# EAGLE design BASEBOARD-2-V.1.0 (EAGLE 5.06)
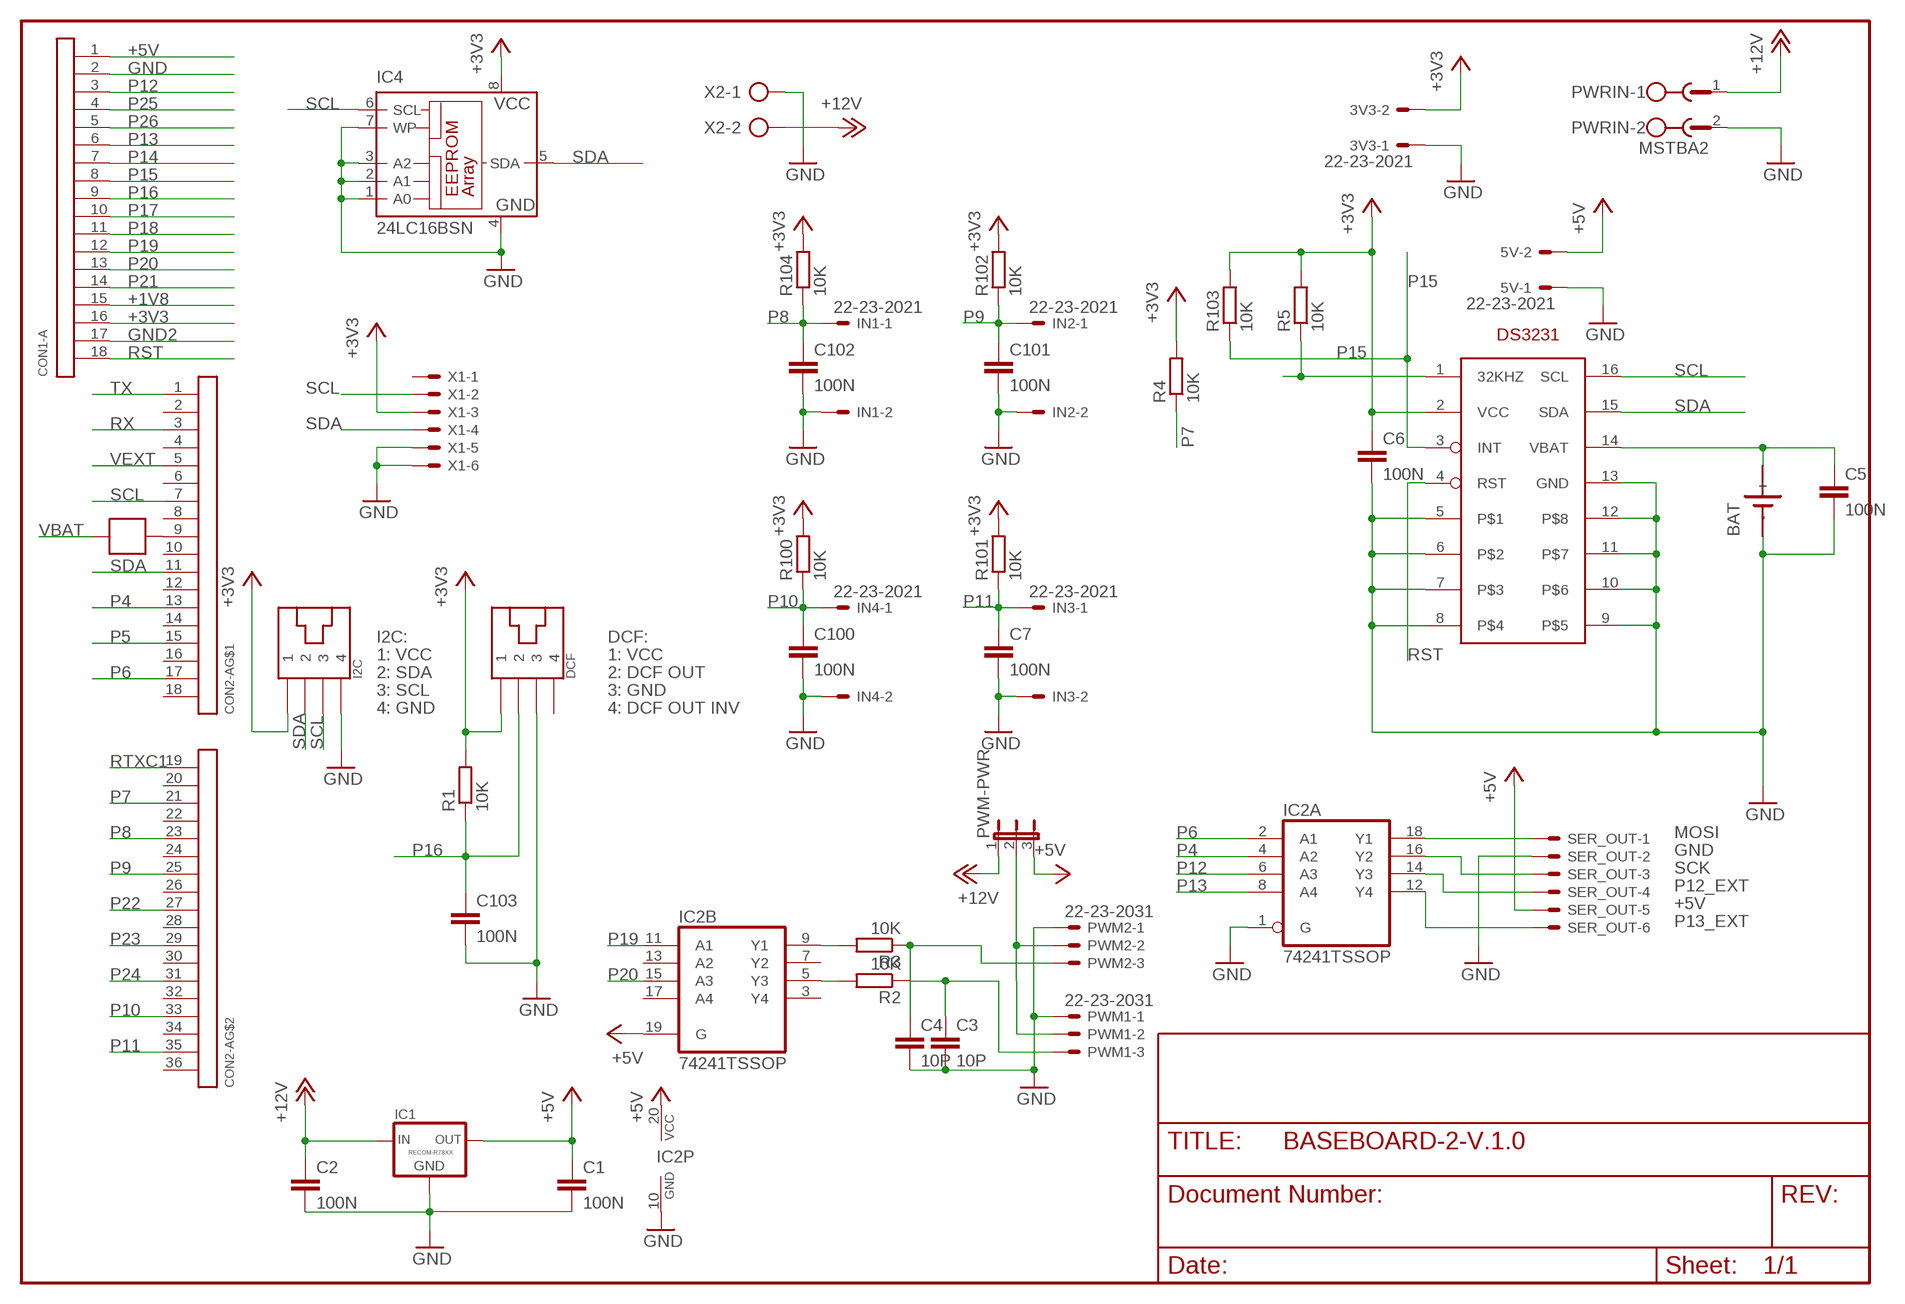
[diagram p0: schematic, sheet 1]

## Parts
3V3  22-23-2021  [22-23-2021]
5V  22-23-2021  [22-23-2021]
BAT  SN2032  [SN2032]
C1  100N  C-EUC0805  [C0805]
C2  100N  C-EUC0805  [C0805]
C3  10P  C-EUC0805  [C0805]
C4  10P  C-EUC0805  [C0805]
C5  100N  C-EUC0805  [C0805]
C6  100N  C-EUC0805  [C0805]
C7  100N  C-EUC0805  [C0805]
C100  100N  C-EUC0805  [C0805]
C101  100N  C-EUC0805  [C0805]
C102  100N  C-EUC0805  [C0805]
C103  100N  C-EUC0805  [C0805]
CON1-A  CON18ARMCON  [CON-ARMED-18-1]
CON2-A  CON18-2  [CON-ARMED-18-2]
DCF  PC_INTERNAL_AUDIO_4  [PC_INTERNAL_AUDIO_4]
I2C  PC_INTERNAL_AUDIO_4  [PC_INTERNAL_AUDIO_4]
IC1  RECOM-R78XX  [RECOM-R785]
IC2  74241TSSOP  [TSSOP20]
IC3  DS3231  [SO16]
IC4  24LC16BSN  [SO-08]
IN1  22-23-2021  [22-23-2021]
IN2  22-23-2021  [22-23-2021]
IN3  22-23-2021  [22-23-2021]
IN4  22-23-2021  [22-23-2021]
PWM1  22-23-2031  [22-23-2031]
PWM2  22-23-2031  [22-23-2031]
PWM-PWR  JP2E  [JP2]
PWRIN  MSTBA2  [MSTBA2]
R1  10K  R-EU_M0805  [M0805]
R2  10K  R-EU_M0805  [M0805]
R3  10K  R-EU_M0805  [M0805]
R4  10K  R-EU_M0805  [M0805]
R5  10K  R-EU_M0805  [M0805]
R100  10K  R-EU_M0805  [M0805]
R101  10K  R-EU_M0805  [M0805]
R102  10K  R-EU_M0805  [M0805]
R103  10K  R-EU_M0805  [M0805]
R104  10K  R-EU_M0805  [M0805]
SER_OUT  22-23-2061  [22-23-2061]
U$1  SOLDERJUMPER  [SOLDERJUMP1]
X1  22-23-2061  [22-23-2061]
X2  AK500/2  [AK500/2]

## Nets
32KHZ: IC3.1(32KHZ) R5.1
+1V8: CON1-A.15
+3V3: 3V3.2 C6.1 CON1-A.16 DCF.P$1 I2C.P$1 IC3.2(VCC) IC4.8(VCC) R1.2 R4.2 R5.2 R100.2 R101.2 R102.2 R103.2 R104.2 X1.3
+5V: 5V.2 C1.1 CON1-A.1 IC1.3(OUT) IC2.19(B:G) IC2.20(P:VCC) PWM-PWR.3 SER_OUT.5
+12V: C2.1 IC1.1(IN) PWM-PWR.1 PWRIN.1 X2.2
GND: 3V3.1 5V.1 BAT.- C1.2 C2.2 C3.2 C4.2 C5.2 C6.2 C7.2 C100.2 C101.2 C102.2 C103.2 CON1-A.2 DCF.P$3 I2C.P$4 IC1.2(GND) IC2.1(A:G) IC2.10(P:GND) IC3.5 IC3.6 IC3.7 IC3.8 IC3.9 IC3.10 IC3.11 IC3.12 IC3.13(GND) IC4.1(A0) IC4.2(A1) IC4.3(A2) IC4.4(GND) IC4.7(WP) IN1.2 IN2.2 IN3.2 IN4.2 PWM1.1 PWM2.1 PWRIN.2 SER_OUT.2 X1.5 X1.6 X2.1
GND2: CON1-A.17
MOSI: IC2.18(A:Y1) SER_OUT.1
N$5: C4.1 PWM2.3 R3.1
N$6: C3.1 PWM1.3 R2.1
N$7: PWM1.2 PWM2.2 PWM-PWR.2
N$8: IC2.9(B:Y1) R3.2
N$9: IC2.5(B:Y3) R2.2
N$10: CON2-A.9 U$1.1
P4: CON2-A.13 IC2.4(A:A2)
P5: CON2-A.15
P6: CON2-A.17 IC2.2(A:A1)
P7: CON2-A.21 R4.1
P8: C102.1 CON2-A.23 IN1.1 R104.1
P9: C101.1 CON2-A.25 IN2.1 R102.1
P10: C100.1 CON2-A.33 IN4.1 R100.1
P11: C7.1 CON2-A.35 IN3.1 R101.1
P12: CON1-A.3 IC2.6(A:A3)
P12_EXT: IC2.14(A:Y3) SER_OUT.4
P13: CON1-A.6 IC2.8(A:A4)
P13_EXT: IC2.12(A:Y4) SER_OUT.6
P14: CON1-A.7
P15: CON1-A.8 IC3.3(INT) R103.1
P16: C103.1 CON1-A.9 DCF.P$2 R1.1
P17: CON1-A.10
P18: CON1-A.11
P19: CON1-A.12 IC2.11(B:A1)
P20: CON1-A.13 IC2.15(B:A3)
P21: CON1-A.14
P22: CON2-A.27
P23: CON2-A.29
P24: CON2-A.31
P25: CON1-A.4
P26: CON1-A.5
RST: CON1-A.18 IC3.4(RST)
RTXC1: CON2-A.19
RX: CON2-A.3
SCK: IC2.16(A:Y2) SER_OUT.3
SCL: CON2-A.7 I2C.P$3 IC3.16(SCL) IC4.6(SCL) X1.2
SDA: CON2-A.11 I2C.P$2 IC3.15(SDA) IC4.5(SDA) X1.4
TX: CON2-A.1
VBAT: BAT.+ C5.1 IC3.14(VBAT) U$1.2
VEXT: CON2-A.5
Unconnected: CON2-A.2 CON2-A.4 CON2-A.6 CON2-A.8 CON2-A.10 CON2-A.12 CON2-A.14 CON2-A.16 CON2-A.18 CON2-A.20 CON2-A.22 CON2-A.24 CON2-A.26 CON2-A.28 CON2-A.30 CON2-A.32 CON2-A.34 CON2-A.36 DCF.P$4 IC2.3(B:Y4) IC2.7(B:Y2) IC2.13(B:A2) IC2.17(B:A4) X1.1

## Notes on the sheet
- I2C: | DCF:
- 1: VCC | 1: VCC
- 2: SDA | 2: DCF OUT
- 3: SCL | 3: GND
- 4: GND | 4: DCF OUT INV

## Library data of the parts
3V3 5V IN1-IN4 = con-molex:22-23-2021: .100" (2.54mm) Center Header - 2 Pin
BAT = turbod3:SN2032: LI BATTERY
C1-C7 C100-C103 = turbod3:C-EU: CAPACITOR, European symbol
CON1-A = turbod3:CON18
CON2-A = turbod3:CON18-2
DCF I2C = turbod3:PC_INTERNAL_AUDIO_4
IC1 = turbod3:RECOM-R78XX
IC2 = 74xx-eu:74*241: Octal BUFFER and LINE DRIVER, 3-state
IC3 = DS3231:DS3231
IC4 = microchip-5:24*: Serial EEPROM I2C
PWM1 PWM2 = con-molex:22-23-2031: .100" (2.54mm) Center Header - 3 Pin
PWM-PWR = jumper:JP2E: JUMPER
PWRIN = con-phoenix-508:MSTBA2: PHOENIX
R1-R5 R100-R104 = turbod3:R-EU_: RESISTOR, European symbol
SER_OUT X1 = con-molex:22-23-2061: .100" (2.54mm) Center Header - 6 Pin
U$1 = turbod3:SOLDERJUMPER
X2 = con-ptr500:AK500/2: CONNECTOR

## Board
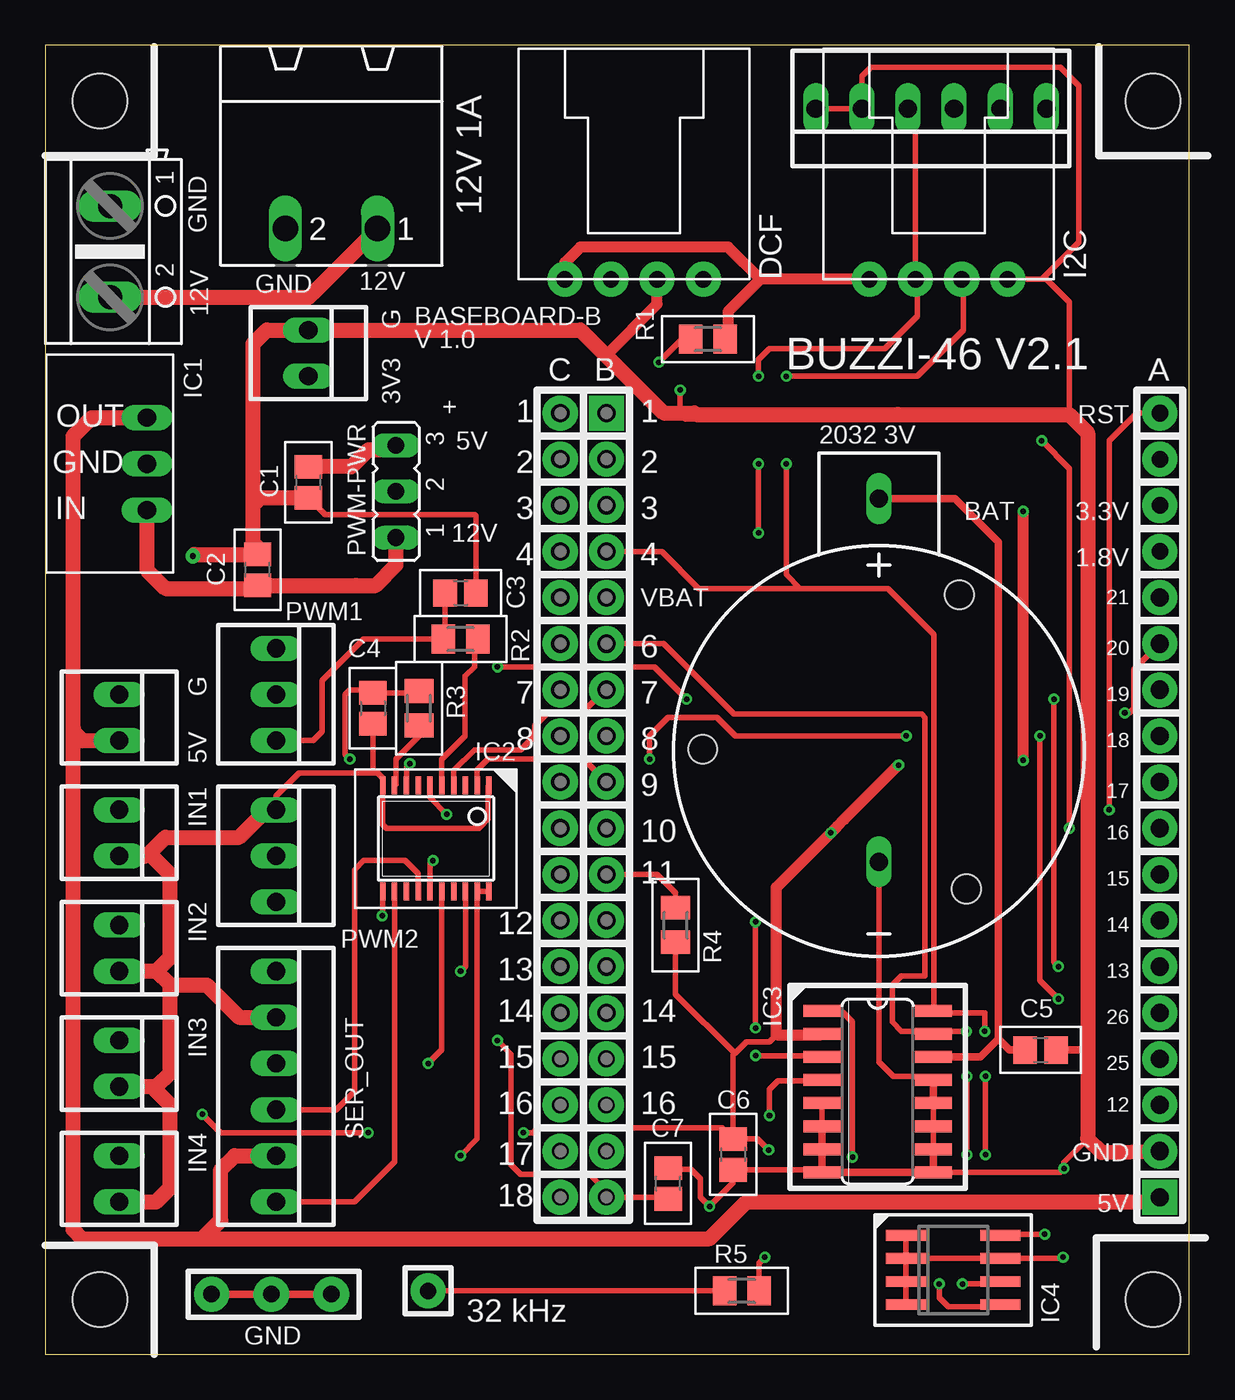
[diagram p1: board, top side]
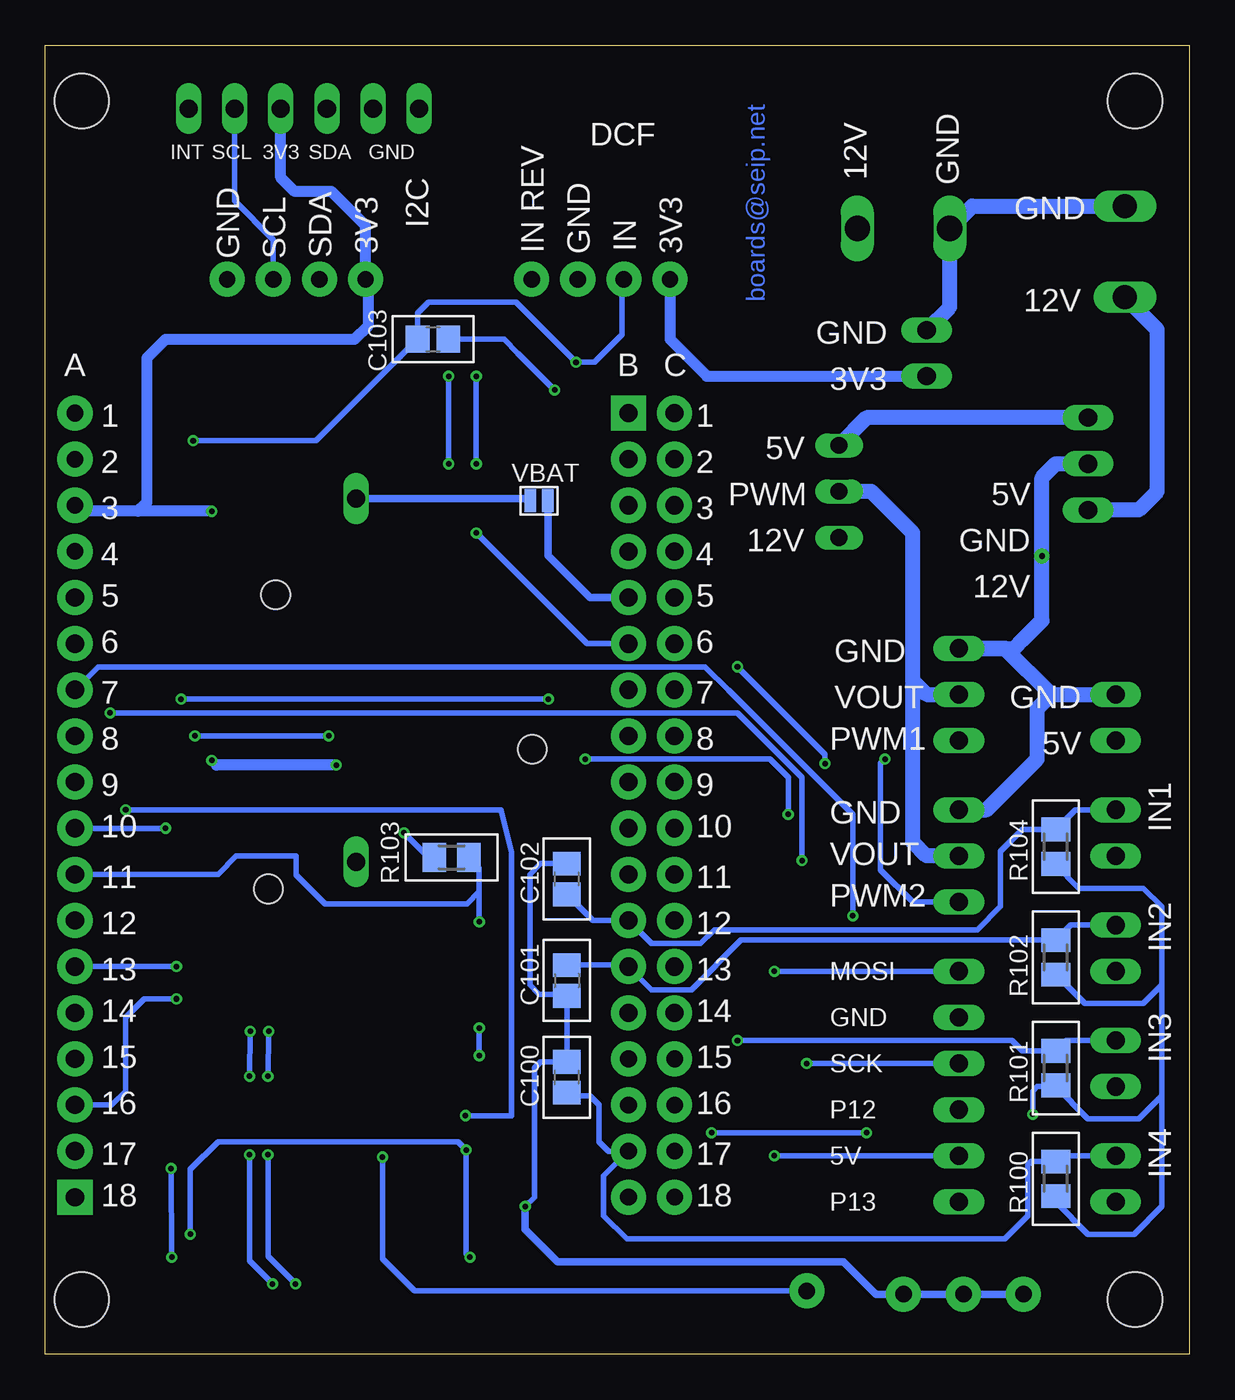
[diagram p2: board, bottom side, seen from below]

Size 63 x 72.06 mm. Coordinates in mm from the lower left corner, seen from the top.
Outline: 0,72.06 0,0 63,0 63,72.06 0,72.06
Copper layers (1*16): Top 0.035mm / dielectric 1.5mm / Bottom 0.035mm
Design rules "PCB-POOL": minimum track width 6mil, minimum drill 12mil, track to track 6mil, track to pad 6mil, pad to pad 6mil, via to via 6mil, smd to smd 6mil, copper to edge 20mil, drill to drill 8mil, minimum pad ring 8mil, minimum via ring 6mil, stop-mask expansion 3mil, vias tented up to drill 0mil, thermal gap 8mil
Holes 3 mm at 61,69 61,3 3,3 3,69

### Footprints (pad centres in the part's own frame; a part is rotated, then mirrored left to right if it is on the bottom)
22-23-2021 = drill 1 long: 1 -1.27,0; 2 1.27,0
SN2032 = drill 1 long: + 0,13.9; - 0,-6.1 | hole 1.6: 4.44,8.6; -9.7,0.1; 4.83,-7.6
C0805 = smd 1.3 x 1.5: 1 -0.85,0; 2 0.85,0
CON-ARMED-18-1 = drill 1 pad 1.93 square: 1 -21.59,0 | drill 1 pad 1.93 round: 2 -19.05,0; 3 -16.51,0; 4 -13.97,0; 5 -11.43,0; 6 -8.89,0; 7 -6.35,0; 8 -3.81,0; 9 -1.27,0; 10 1.27,0; 11 3.81,0; 12 6.35,0; 13 8.89,0; 14 11.43,0 | drill 0.914 pad 1.93 round: 15 13.97,0; 16 16.51,0; 17 19.05,0; 18 21.59,0
CON-ARMED-18-2 = drill 1 pad 1.93 square: 1 -21.59,1.27 | drill 1 pad 1.93 round: 2 -21.59,-1.27; 3 -19.05,1.27; 4 -19.05,-1.27; 5 -16.51,1.27; 6 -16.51,-1.27; 7 -13.97,1.27; 8 -13.97,-1.27; 9 -11.43,1.27; 10 -11.43,-1.27; 11 -8.89,1.27; 12 -8.89,-1.27; 13 -6.35,1.27; 14 -6.35,-1.27; 15 -3.81,1.27; 16 -3.81,-1.27; 17 -1.27,1.27; 18 -1.27,-1.27; 19 1.27,1.27; 20 1.27,-1.27; 21 3.81,1.27; 22 3.81,-1.27; 23 6.35,1.27; 24 6.35,-1.27; 25 8.89,1.27; 26 8.89,-1.27; 27 11.43,1.27; 28 11.43,-1.27 | drill 0.914 pad 1.93 round: 29 13.97,1.27; 30 13.97,-1.27; 31 16.51,1.27; 32 16.51,-1.27; 33 19.05,1.27; 34 19.05,-1.27; 35 21.59,1.27; 36 21.59,-1.27
PC_INTERNAL_AUDIO_4 = drill 0.9 pad 1.93 round: P$1 -3.81,-6.35; P$2 -1.27,-6.35; P$3 1.27,-6.35; P$4 3.81,-6.35
RECOM-R785 = drill 1 long: 1 2.54,2.54; 2 0,2.54; 3 -2.54,2.54
TSSOP20 = smd 0.305 x 0.991: 1 -2.925,-2.918; 2 -2.275,-2.918; 3 -1.625,-2.918; 4 -0.975,-2.918; 5 -0.325,-2.918; 6 0.325,-2.918; 7 0.975,-2.918; 8 1.625,-2.918; 9 2.275,-2.918; 10 2.925,-2.918; 11 2.925,2.918; 12 2.275,2.918; 13 1.625,2.918; 14 0.975,2.918; 15 0.325,2.918; 16 -0.325,2.918; 17 -0.975,2.918; 18 -1.625,2.918; 19 -2.275,2.918; 20 -2.925,2.918
SO16 = smd 0.66 x 2.032: 1 -4.445,-3.073; 2 -3.175,-3.073; 3 -1.905,-3.073; 4 -0.635,-3.073; 5 0.635,-3.073; 6 1.905,-3.073; 7 3.175,-3.073; 8 4.445,-3.073; 9 4.445,3.073; 10 3.175,3.073; 11 1.905,3.073; 12 0.635,3.073; 13 -0.635,3.073; 14 -1.905,3.073; 15 -3.175,3.073; 16 -4.445,3.073
SO-08 = smd 0.6 x 2.2: 1 -1.905,-2.6; 2 -0.635,-2.6; 3 0.635,-2.6; 4 1.905,-2.6; 5 1.905,2.6; 6 0.635,2.6; 7 -0.635,2.6; 8 -1.905,2.6
22-23-2031 = drill 1 long: 1 -2.54,0; 2 0,0; 3 2.54,0
JP2 = drill 0.914 long: 1 -2.54,0; 2 0,0; 3 2.54,0
MSTBA2 = drill 1.397 long: 1 -2.54,5.08; 2 2.54,5.08
M0805 = smd 1.3 x 1.6: 1 -0.95,0; 2 0.95,0
22-23-2061 = drill 1 long: 1 -6.35,0; 2 -3.81,0; 3 -1.27,0; 4 1.27,0; 5 3.81,0; 6 6.35,0
SOLDERJUMP1 = smd 1.27 x 0.635: 1 0,0.483; 2 0,-0.483
AK500/2 = drill 1.321 long: 1 -2.515,0; 2 2.515,0

### Placement (x,y rotation side)
3V3  14.48,55.12 270 top
5V  4.06,35.05 270 top
BAT  45.89,33.21 0 top
C1  14.48,48.01 270 top
C2  11.68,43.18 90 top
C3  22.86,41.91 0 top
C4  18.03,35.56 270 top
C5  54.8,16.74 0 top
C6  37.87,11 270 top
C7  34.29,9.4 90 top
C100  34.29,15.24 90 bottom
C101  34.29,20.57 270 bottom
C102  34.29,26.16 90 bottom
C103  41.66,55.88 0 bottom
CON1-A  61.37,30.23 90 top
CON2-A  29.62,30.23 270 top
DCF  32.42,65.53 0 top
I2C  49.18,65.53 0 top
IC1  3.05,49.02 270 top
IC2  21.5,28.38 180 top
IC3  45.82,14.46 270 top
IC4  49.99,4.63 270 top
IN1  4.06,28.7 270 top
IN2  4.06,22.35 270 top
IN3  4.06,16 270 top
IN4  4.06,9.65 270 top
PWM1  12.7,36.32 270 top
PWM2  12.7,27.43 270 top
PWM-PWR  19.3,47.5 90 top
PWRIN  15.75,67.06 180 top
R1  36.48,55.88 0 top
R2  22.86,39.37 0 top
R3  20.57,35.56 270 top
R4  34.7,23.62 270 top
R5  38.35,3.48 0 top
R100  7.37,9.65 270 bottom
R101  7.37,15.75 270 bottom
R102  7.37,21.84 270 bottom
R103  40.63,27.36 180 bottom
R104  7.37,27.94 270 bottom
SER_OUT  12.7,14.73 270 top
U$1  35.81,46.99 270 bottom
X1  48.77,68.58 180 top
X2  3.56,60.71 270 top

### Tracks (layer width: path | path; a pad name or v marks a point on that pad's centre or on a via)
32KHZ  (via drill 0.3 pad 0.61, 0.9 pad 1.93)
  Top 0.305: v21.07,3.48 R5.1 | v44.44,10.85 44.44,18.3 43.89,18.86 42.8,18.86 IC3.1
  Bottom 0.305: v44.44,10.85 44.44,5.26 42.66,3.48 v21.07,3.48
+3V3  (via drill 0.3, 0.3 pad 0.25, 0.3 pad 0.61)
  Top 0.305: C6.1 37.87,16.47 37.96,16.55 | 37.96,16.55 38.6,17.2 39.87,17.2 40.25,17.58 | 42.69,17.58 IC3.2 | 43.98,29.43 43.89,29.34 | v39.83,11.24 39.22,11.85 C6.1 | v39.62,5.33 39.3,5.01 R5.2 | v55.02,6.6 52.65,6.6 IC4.8 | C6.1 37.27,12.45 27.08,12.45 26.83,12.19 v26.32,12.19 | R4.2 34.7,19.81 37.96,16.55 | 37.94,56.39 R1.2 37.24,55.69 | v8.64,13.21 9.65,12.19 v17.78,12.19 | v43.25,28.71 43.61,29.06
  Top 0.61: v53.84,32.69 v53.84,46.41 | v46.98,32.44 43.98,29.43 43.61,29.06 v43.25,28.71 40.25,25.7 40.25,17.58 42.69,17.58 | I2C.P$1 39.37,59.18 | 39.37,59.18 37.59,57.4 37.59,56.04 R1.2 | DCF.P$1 28.61,60.1 29.46,60.96 37.59,60.96 39.37,59.18
  Bottom 0.305: v55.02,6.6 55.02,10.16 53.5,11.68 40.29,11.68 v39.83,11.24 39.83,5.54 v39.62,5.33 | 7.43,20.83 R102.2 5.78,19.3 2.54,19.3 1.52,20.32 | 7.43,8.64 R100.2 7.37,8.38 5.59,6.6 3.05,6.6 1.52,8.13 1.52,14.48 | R104.2 7.37,26.92 6.1,25.65 2.54,25.65 1.52,24.64 1.52,20.32 | 1.52,14.48 1.52,14.22 2.79,12.95 5.59,12.95 7.37,14.73 R101.2 7.43,14.73 8.38,14.73 8.64,14.48 v8.64,13.21 | 1.52,14.48 1.52,20.32 | v17.78,12.19 v26.32,12.19 | R103.2 41.9,27.36 v43.25,28.71
  Bottom 0.406: 53.59,32.44 v53.84,32.69
  Bottom 0.61: v46.98,32.44 53.59,32.44 | v53.84,46.41 57.91,46.41 | 57.91,46.41 61.21,46.41 CON1-A.16 | 3V3.2 26.57,53.85 28.61,55.88 DCF.P$1 | 57.91,46.41 57.4,46.91 57.4,47.75 57.4,54.86 56.39,55.88 48.01,55.88 45.97,55.88 45.21,56.64 45.21,59.02 I2C.P$1 45.37,62.13 47.24,64.01 49.28,64.01 50.04,64.77 X1.3
+5V  (via drill 0.3)
  Top 0.305: IC2.20 IC2.19 23.78,11.84 v22.86,10.92
  Top 0.813: 1.52,34.54 1.52,34.29 2.03,33.78 5V.2 | 1.52,34.54 1.52,45.21 1.52,49.53 1.52,50.55 2.54,51.56 IC1.3 | 2.03,6.35 36.58,6.35 38.61,8.38 57.66,8.38 61.12,8.38 CON1-A.1 | 1.52,34.54 1.52,33.78 1.52,7.62 1.52,6.86 2.03,6.35 | 2.03,6.35 8.64,6.35 9.65,7.37 9.65,10.16 10.41,10.92 SER_OUT.5 | C1.1 16.85,48.86 17.78,49.78 19.05,49.78 PWM-PWR.3
  Bottom 0.305: SER_OUT.5 v22.86,10.92
  Bottom 0.813: IC1.3 17.78,51.56 PWM-PWR.3
+12V
  Top 0.813: C2.1 11.6,42.42 | C2.1 17.11,42.33 18.2,42.33 19.3,43.43 PWM-PWR.1 | IC1.1 5.59,43.18 6.6,42.16 11.52,42.16 C2.1 | PWRIN.1 14.99,58.67 14.5,58.19 X2.2
  Bottom 0.813: IC1.1 2.79,46.48 1.78,47.5 1.78,56.41 X2.2
GND  (via drill 0.3, 0.3 pad 0.81, 0.9 pad 1.93)
  Top 0.305: IC4.4 IC4.3 IC4.2 | IC4.2 IC4.1 | IC4.2 IC4.7 55.97,5.27 v56.04,5.33 | IC3.6 IC3.5 | IC3.8 42.62,10.15 C6.2 37.87,9.42 v36.58,8.13 36.07,8.64 36.07,9.65 35.56,10.16 34.38,10.16 C7.2 | BAT.- 45.89,16.09 46.68,15.3 48.69,15.3 IC3.13 | IC3.12 IC3.11 IC3.10 | 57.4,16.82 57.31,16.74 | 57.4,11.86 56.08,10.55 v56.08,10.22 55.88,10.01 IC3.9 | 46.94,51.74 46.98,51.78 | 56.38,51.74 56.38,57.32 56.38,57.92 55.12,59.18 I2C.P$4 54.86,59.18 56.9,61.21 56.9,69.85 55.88,70.87 45.47,70.87 44.96,70.36 X1.5 X1.6 | v34.96,53.09 34.96,52.08 35.3,51.74 | IC2.1 24.38,31.26 24.38,29.46 23.88,28.96 18.8,28.96 18.58,29.18 IC2.10 18.58,31.71 18.29,32 18.03,32 | 18.03,32 14.48,32 13.97,32 12.7,30.73 PWM2.1 12.19,29.97 | 18.03,32 C4.2 | C3.2 23.71,46.14 23.62,46.23 15.41,46.23 C1.2
  Top 0.406: IC3.6 IC3.7 IC3.8 IC3.9 IC3.10 | IC3.12 IC3.13 | 57.31,16.74 C5.2 | 5.84,27.43 IN1.2 | 6.1,21.08 IN2.2 | 5.84,14.73 IN3.2 | v9.14,3.3 v12.45,3.3 v15.75,3.3
  Top 0.61: 35.74,51.82 35.81,51.74 | DCF.P$3 33.69,57.82 30.86,54.99
  Top 0.813: CON1-A.2 58.16,11.1 57.4,11.86 57.4,16.82 57.4,50.72 56.38,51.74 46.94,51.74 35.81,51.74 35.3,51.74 | 3V3.1 14.22,56.64 | 3V3.1 12.19,56.39 11.43,55.63 11.43,48.51 11.43,46.74 | 11.43,46.74 11.43,45.97 11.43,44.28 C2.2 | C2.2 11.68,44.45 | C1.2 11.85,47.16 11.43,46.74 | IN1.2 5.59,27.43 6.6,28.45 10.67,28.45 12.19,29.97 | 5.84,27.43 6.86,26.42 6.86,25.65 6.86,21.84 6.1,21.08 | 6.1,21.08 IN2.2 | 6.86,20.32 6.1,21.08 | 6.86,20.32 6.86,15.49 6.1,14.73 IN3.2 | 5.84,14.73 6.86,13.72 6.86,9.14 6.1,8.38 IN4.2 | 6.86,20.32 8.89,20.32 10.67,18.54 SER_OUT.2 | 3V3.1 29.46,56.39 30.86,54.99 34.04,51.82 35.74,51.82 | C2.2 8.22,44.03 v8.13,43.94
  Bottom 0.305: v56.08,10.22 v56.04,5.33 | v34.96,53.09 36.99,55.12 37.75,55.88 C103.2 | C102.2 35.73,27.01 36.32,26.42 36.32,20.32 35.81,19.81 34.38,19.81 C101.2 C100.2 35.73,16.09 36.07,15.75 36.07,10.92 36.07,8.64 v36.58,8.13
  Bottom 0.406: v9.14,3.3 17.27,3.3 19.05,5.08 34.8,5.08 36.58,6.86 v36.58,8.13
  Bottom 0.813: PWM2.1 11.18,29.97 8.38,32.77 8.38,35.56 7.62,36.32 | 7.62,36.32 5V.1 | 11.68,38.86 10.16,38.86 7.62,36.32 | 11.68,38.86 PWM1.1 | 11.68,38.86 9.65,38.86 9.14,39.37 8.13,40.39 v8.13,43.94 8.13,48.26 7.37,49.02 IC1.2 | 3V3.1 13.21,57.66 PWRIN.2 11.96,63.22 X2.1
MOSI  (via drill 0.3)
  Top 0.305: IC2.18 23.13,21.35 v22.86,21.08
  Bottom 0.305: SER_OUT.1 v22.86,21.08
N$5  (via drill 0.3)
  Top 0.305: R3.1 20.47,36.41 C4.1 17.87,36.58 16.76,36.58 16.51,36.32 16.51,33.02 v16.76,32.77
  Bottom 0.305: PWM2.3 15.24,24.89 17.02,26.67 17.02,32 17.02,32.51 v16.76,32.77
N$6
  Top 0.305: PWM1.3 14.73,33.78 15.24,34.29 15.24,37.08 16.51,38.35 17.53,39.37 R2.1 22.01,39.47 C3.1
N$7
  Bottom 0.813: 15.11,36.96 14.48,36.32 PWM1.2 | 15.11,36.96 15.24,37.08 15.24,41.4 15.24,45.21 17.53,47.5 PWM-PWR.2 | PWM2.2 14.48,27.43 15.24,28.19 15.24,36.83 15.11,36.96
N$8
  Top 0.305: R3.2 20.57,34.04 19.3,32.77 19.3,31.38 IC2.9
N$9
  Top 0.305: IC2.5 21.83,32.75 23.11,34.04 23.11,37.34 23.62,37.85 23.62,39.18 R2.2
N$10
  Bottom 0.406: U$1.1 35.33,43.97 33.02,41.66 CON2-A.9
P4
  Top 0.305: CON2-A.13 30.82,36.58 29.62,35.38 29.62,35.36 29.62,35.31 27.64,35.31 26.92,34.59 26.92,34.04 26.16,33.27 25.15,33.27 23.62,33.27 22.48,32.13 IC2.4
P6
  Top 0.305: CON2-A.17 29.62,32.77 27.34,32.77 24.38,32.77 23.78,32.16 IC2.2
P7
  Top 0.305: R4.1 34.7,25.4 33.69,26.42 CON2-A.21
P8
  Bottom 0.305: IN1.1 6.28,29.97 R104.1 9.21,28.89 10.41,27.69 10.41,24.64 11.68,23.37 26.16,23.37 26.92,22.61 29.62,22.61 CON2-A.23 32.85,23.88 C102.1
P9
  Bottom 0.305: IN2.1 6.54,23.62 R102.1 24.7,22.79 27.43,20.07 29.62,20.07 CON2-A.25 30.98,21.42 C101.1
P10
  Bottom 0.305: IN4.1 7.05,10.92 R100.1 8.7,10.6 8.89,10.41 8.89,7.62 10.16,6.35 30.99,6.35 32.26,7.62 32.26,9.81 CON2-A.33 32,11.18 32.51,11.68 32.51,13.72 33.02,14.22 34.12,14.22 C100.1
P11  (via drill 0.3)
  Top 0.305: 34.2,8.64 C7.1 34.2,8.64 | v24.89,17.27 25.65,16.51 25.65,10.41 26.16,9.91 29.97,9.91 30.89,8.99 CON2-A.35 34.2,8.64
  Bottom 0.305: IN3.1 6.79,17.27 R101.1 9.21,16.7 9.78,17.27 v24.89,17.27
P12  (via drill 0.3)
  Top 0.305: v47.4,34.04 38,34.04 36.99,35.05 34.29,35.05 33.27,34.04 v33.27,32.77 | v54.77,34.04 54.77,20.57 v55.78,19.56 | IC2.6 21.18,30.64 v22.1,29.72
  Bottom 0.305: v47.4,34.04 v54.77,34.04 | v55.78,19.56 57.56,19.56 58.58,18.54 58.58,14.48 59.34,13.72 CON1-A.3 | v22.1,29.72 22.1,31.75 23.11,32.77 v33.27,32.77
P12_EXT
  Top 0.305: 20.53,26.46 IC2.14 20.53,26.46 | 20.53,26.46 20.32,26.67 | SER_OUT.4 16,13.46 17.02,14.48 17.02,26.67 17.53,27.18 19.81,27.18 20.53,26.46
P13  (via drill 0.3)
  Top 0.305: v55.53,36.07 55.53,21.59 v55.78,21.34 | IC2.8 19.88,32.32 v20.07,32.51 | v24.89,37.85 33.53,37.85 v35.31,36.07
  Bottom 0.305: v55.53,36.07 55.02,36.07 46.89,36.07 46.64,36.07 40.89,36.07 v35.31,36.07 | v55.78,21.34 CON1-A.6 | v20.07,32.51 20.07,33.02 v24.89,37.85
P13_EXT
  Top 0.305: IC2.12 19.23,10.59 17.02,8.38 SER_OUT.6
P15  (via drill 0.3)
  Top 0.305: v39.11,17.96 v39.11,23.8 | v39.11,16.43 42.68,16.43 IC3.3
  Bottom 0.305: CON1-A.8 53.5,26.42 52.49,27.43 49.18,27.43 49.18,26.37 47.6,24.79 39.79,24.79 39.11,25.48 | v39.11,16.43 v39.11,17.96 | v39.11,23.8 39.11,25.07 39.11,25.48 | 39.11,25.48 39.11,26.78 R103.1
P16  (via drill 0.3)
  Top 0.305: v56.39,28.96 56.39,48.77 v54.86,50.29 | R1.1 35.05,55.88 v33.78,54.61
  Bottom 0.305: v56.39,28.96 CON1-A.9 | v54.86,50.29 48.09,50.29 C103.1 | C103.1 42.51,56.3 | DCF.P$2 31.24,59.09 31.24,56.13 32.77,54.61 v33.78,54.61 37.08,57.91 41.91,57.91 42.51,57.32 C103.1
P19  (via drill 0.3)
  Top 0.305: IC2.11 18.58,24.42 v18.54,24.13
  Bottom 0.305: CON1-A.12 60.1,37.85 46.89,37.85 39.88,37.85 26.67,37.85 25.4,36.58 23.62,34.8 22.86,34.04 18.54,29.72 v18.54,24.13
P20  (via drill 0.3)
  Top 0.305: IC2.15 21.18,27.02 v21.34,27.18 | v59.44,35.31 59.69,35.31 59.94,35.56 59.94,37.69 CON1-A.13
  Bottom 0.305: v21.34,27.18 21.34,31.75 23.62,34.04 24.89,35.31 41.79,35.31 v59.44,35.31
RST  (via drill 0.3, 0.3 pad 0.61)
  Top 0.305: v39.87,13.13 39.87,14.58 40.33,15.05 42.7,15.05 IC3.4 | CON1-A.18 60.1,51.82 58.58,50.29 v58.58,29.97
  Bottom 0.305: v39.87,13.13 37.33,13.13 37.33,27.61 37.91,29.97 v58.58,29.97
SCK  (via drill 0.3)
  Top 0.305: IC2.16 21.83,16.75 v21.08,16
  Bottom 0.305: SER_OUT.3 v21.08,16
SCL  (via drill 0.3)
  Top 0.305: CON2-A.7 33.94,44.2 35.97,42.16 41.56,42.16 | 41.56,42.16 46.39,42.16 48.93,39.62 48.93,34.8 48.93,20.32 48.93,20.07 48.93,18.93 IC3.16 49,18.8 51.72,18.8 v51.72,17.78 | v51.76,10.98 v51.76,15.3 | v50.49,3.87 52.46,3.87 IC4.6 | v40.8,49.02 40.8,42.93 41.56,42.16 | v40.8,53.85 48.01,53.85 50.55,56.39 50.55,59.09 I2C.P$3
  Bottom 0.305: v51.76,15.3 v51.72,17.78 | v51.76,10.98 51.76,5.14 v50.49,3.87 | v40.8,49.02 v40.8,53.85 | I2C.P$3 50.45,61.37 52.58,63.5 X1.2
SDA  (via drill 0.3)
  Top 0.305: 34.04,39.12 CON2-A.11 | 34.04,39.12 37.9,35.26 48.25,35.26 48.42,35.06 48.42,35.05 48.42,20.83 47.15,20.83 46.64,20.32 46.64,18.29 47.15,17.78 49.18,17.78 | 49.18,17.78 IC3.15 | v50.7,17.78 49.18,17.78 | v50.75,10.98 v50.75,15.3 | v49.22,3.87 49.22,3.11 49.73,2.6 52.46,2.6 IC4.5 | v39.27,45.21 v39.27,49.02 | 34.04,39.12 33.69,39.12 | X1.4 47.91,68.17 I2C.P$2 48.01,59.09 48.01,57.15 46.23,55.37 39.88,55.37 39.27,54.77 v39.27,53.85
  Bottom 0.305: v50.75,15.3 v50.7,17.78 | v50.75,10.98 50.75,5.39 v49.22,3.87 | v39.27,49.02 v39.27,53.85 | v39.27,45.21 33.17,39.12 CON2-A.11
VBAT
  Top 0.305: 53.5,16.98 C5.1 53.93,16.76 | 52.48,17.37 52.48,17.53
  Top 0.406: BAT.+ 50.09,47.11 52.48,44.7 52.48,17.53 | 53.93,16.76 53.09,16.76 52.48,17.37 51.48,16.36 IC3.14
  Bottom 0.406: BAT.+ 36.41,47.11 U$1.2

### Text on the board
Bottom: boards@seip.net
tPlace: GND
tNames: 12V 1A | GND | 12V | GND | G | 12V | BASEBOARD-B | V 1.0 | C | B | BUZZI-46 V2.1 | A | + | RST | 1 | 1 | 5V | 2032 3V | 2 | 2 | 3.3V | 3 | 3 | 12V | 1.8V | 4 | 4 | 21 | VBAT | 20 | 6 | G | 19 | 7 | 7 | 18 | 8 | 8 | 9 | 17 | 16 | 10 | 15 | 11 | 14 | 12 | 13 | 13 | 26 | 14 | 14 | 15 | 15 | 25 | 12 | 16 | 16 | GND | 17 | 5V | 18 | 32 kHz
bNames: GND | 12V | DCF | IN REV | GND | SDA | 3V3 | SCL | INT | GND | I2C | 3V3 | 3V3 | SDA | SCL | GND | GND | IN | 12V | GND | C | B | A | 3V3 | 1 | 1 | 5V | 2 | 2 | VBAT | 5V | PWM | 3 | 3 | GND | 12V | 4 | 4 | 12V | 5 | 5 | 6 | 6 | GND | GND | VOUT | 7 | 7 | 5V | PWM1 | 8 | 8 | IN1 | 9 | 9 | GND | 10 | 10 | VOUT | 11 | 11 | IN2 | PWM2 | 12 | 12 | MOSI | 13 | 13 | IN3 | GND | 14 | 14 | 15 | 15 | SCK | P12 | 16 | 16 | IN4 | 5V | 17 | 17 | P13 | 18 | 18